# Altium schematic sheet schematic5.SchDoc
size A
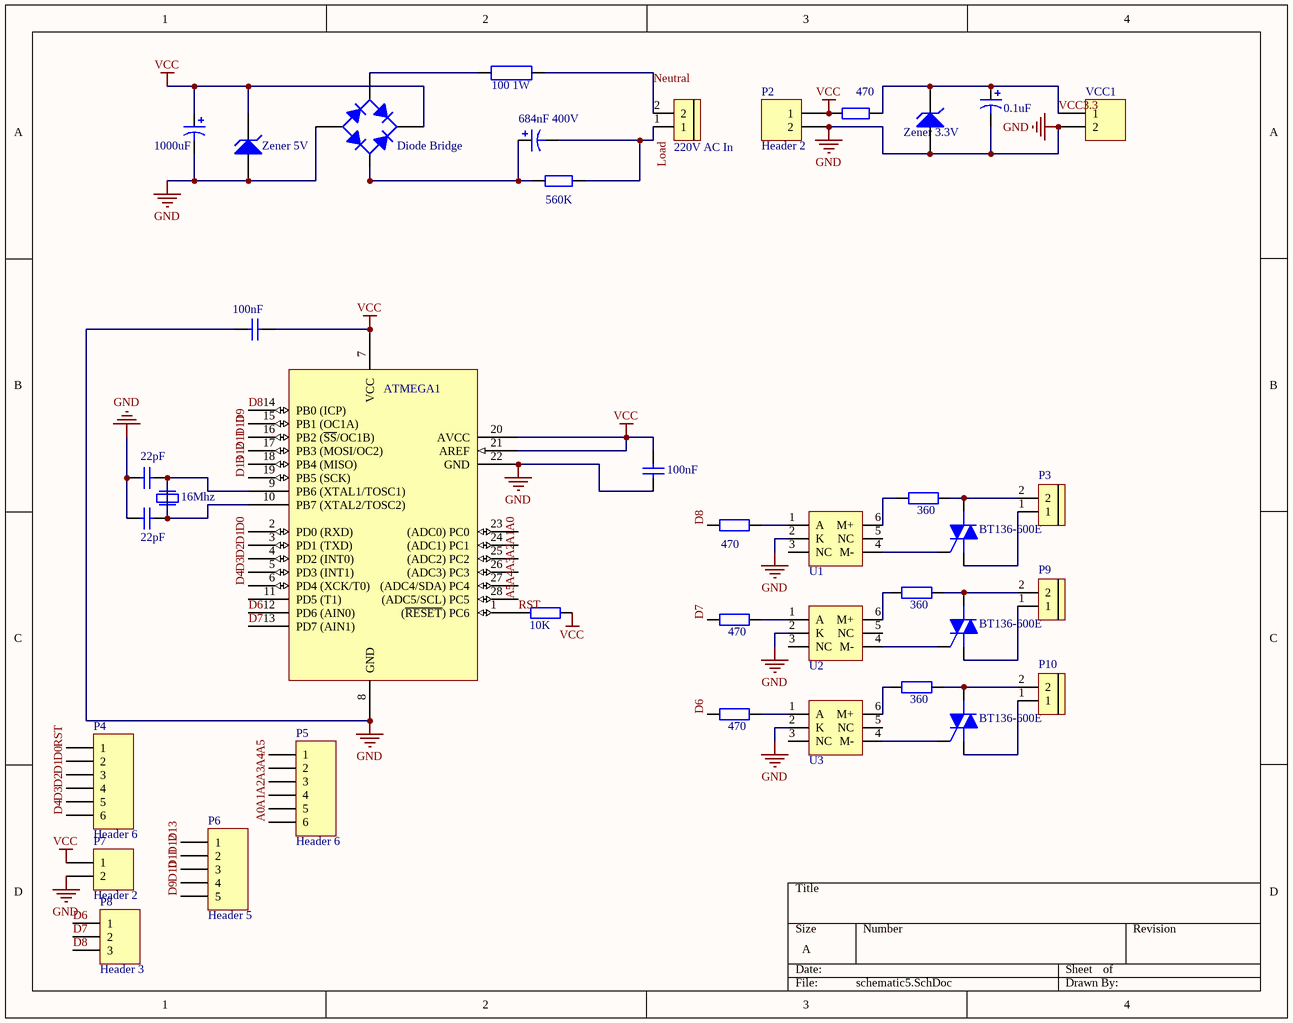
[diagram p0: schematic5.SchDoc]

## Parts
ATMEGA1  ATMEGA8_DIP28  [DIP-28]  (value not drawn)
C1  0.1uF  [C3MM]
C2  684nF 400V  [C10mm]
C3  1000uF  [C10mm]
C4  100nF  [Tu-pico]
C5  22pF  [Tu-pico]
C6  100nF  [Tu-pico]
C7  22pF  [Tu-pico]
Crystal1  16Mhz  [XTAL]
D1  Diode Bridge  [D-38]
D2  Zener 3.3V  [DIODE/NOM/0.5A]
D3  Zener 5V  [DIODE/NOM/0.5A]
P1  220V AC In  [BIG_Header 2]
P2  Header 2  [HDR1X2]
P3  BIG_Header 2  [BIG_Header 2]  (value not drawn)
P4  Header 6  [HDR1X6]
P5  Header 6  [HDR1X6]
P6  Header 5  [HDR1X5]
P7  Header 2  [HDR1X2]
P8  Header 3  [HDR1X3]
P9  BIG_Header 2  [BIG_Header 2]  (value not drawn)
P10  BIG_Header 2  [BIG_Header 2]  (value not drawn)
Q1  BT136-600E  [BTA6-600]
Q2  BT136-600E  [BTA6-600]
Q3  BT136-600E  [BTA6-600]
R1  100 1W  [DIEN TRO 1W (tube)]
R2  value 470  [DIEN TRO 1/4 W]  (hidden comment: R0.4W)
R3  560K  [AXIAL-0.4]
R4  470  [R1/4W]
R5  360  [R1/4W]
R6  10K  [R1/4W]
R7  470  [R1/4W]
R8  360  [R1/4W]
R9  470  [R1/4W]
R10  360  [R1/4W]
U1  MOC3021M  [MOC30XX]  (value not drawn)
U2  MOC3021M  [MOC30XX]  (value not drawn)
U3  MOC3021M  [MOC30XX]  (value not drawn)
VCC1  Header 2  [HDR1X2]  (value not drawn)

## Nets
GND: ATMEGA1.8(GND) ATMEGA1.22(GND) C1.2 C3.2 C4.1 C5.2 C6.1 C7.2 D1.3(A) D2.1(A) D3.1(A) P2.2 P7.2 U1.2(K) U2.2(K) U3.2(K) VCC1.2
VCC: ATMEGA1.7(VCC) ATMEGA1.20(AVCC) ATMEGA1.21(AREF) C3.1 C4.2 C6.2 D1.1(K) D3.2(K) P2.1 P7.1 R2.1 R6.1
A0: ATMEGA1.23((ADC0)_PC0) P5.6
A1: ATMEGA1.24((ADC1)_PC1) P5.5
A2: ATMEGA1.25((ADC2)_PC2) P5.4
A3: ATMEGA1.26((ADC3)_PC3) P5.3
A4: ATMEGA1.27((ADC4/SDA)_PC4) P5.2
A5: ATMEGA1.28((ADC5/SCL)_PC5) P5.1
D0: ATMEGA1.2(PD0_(RXD)) P4.2
D1: ATMEGA1.3(PD1_(TXD)) P4.3
D2: ATMEGA1.4(PD2_(INT0)) P4.4
D3: ATMEGA1.5(PD3_(INT1)) P4.5
D4: ATMEGA1.6(PD4_(XCK/T0)) P4.6
D6: ATMEGA1.12(PD6_(AIN0)) P8.1 R9.1
D7: ATMEGA1.13(PD7_(AIN1)) P8.2 R7.1
D8: ATMEGA1.14(PB0_(ICP)) P8.3 R4.1
D9: ATMEGA1.15(PB1_(OC1A)) P6.5
D10: ATMEGA1.16(PB2_(~{SS}/OC1B)) P6.4
D11: ATMEGA1.17(PB3_(MOSI/OC2)) P6.3
D12: ATMEGA1.18(PB4_(MISO)) P6.2
D13: ATMEGA1.19(PB5_(SCK)) P6.1
Load: C2.2 P1.1 R3.2
Neutral: P1.2 R1.2
RST: ATMEGA1.1((~{RESET})_PC6) P4.1 R6.2
VCC3.3: C1.1 D2.2(K) R2.2 VCC1.1
NetATMEGA1_9: ATMEGA1.9(PB6_(XTAL1/TOSC1)) ATMEGA1.10(PB7_(XTAL2/TOSC2)) C5.1 C7.1 Crystal1.1(P1) Crystal1.2(P2)
NetC2_1: C2.1 D1.2(C) R3.1
NetD1_4: D1.4(C) R1.1
NetP3_1: P3.1 Q1.1(M1)
NetP3_2: P3.2 Q1.2(M2) R5.2
NetP9_1: P9.1 Q2.1(M1)
NetP9_2: P9.2 Q2.2(M2) R8.2
NetP10_1: P10.1 Q3.1(M1)
NetP10_2: P10.2 Q3.2(M2) R10.2
NetQ1_3: Q1.3(G) U1.4(M-)
NetQ2_3: Q2.3(G) U2.4(M-)
NetQ3_3: Q3.3(G) U3.4(M-)
NetR4_2: R4.2 U1.1(A)
NetR5_1: R5.1 U1.6(M+)
NetR7_2: R7.2 U2.1(A)
NetR8_1: R8.1 U2.6(M+)
NetR9_2: R9.2 U3.1(A)
NetR10_1: R10.1 U3.6(M+)

Not connected (* = marked no-connect by the designer): ATMEGA1 11(PD5_(T1)); U1 3(NC) 5(NC); U2 3(NC) 5(NC); U3 3(NC) 5(NC)

## Library data of the parts
ATMEGA1 = ATMEGA8_DIP28: Atmel Microcontroller - Library created by carel..  <www.mpfreezone.com>
C1 = Cap Pol 3mm: Polarized Capacitor (Axial); Published: 8-Jun-2000; LatestRevisionDate: 17-Jul-2002; LatestRevisionNote: Re-released for DXP Platform.; PackageReference: POLAR0.8; Publisher: Altium Limited
C2 = Cap Pol 12mm: Polarized Capacitor (Axial); Published: 8-Jun-2000; LatestRevisionDate: 17-Jul-2002; LatestRevisionNote: Re-released for DXP Platform.; PackageReference: POLAR0.8; Publisher: Altium Limited
C3 = Cap Pol 8mm: Polarized Capacitor (Axial); Published: 8-Jun-2000; LatestRevisionDate: 17-Jul-2002; LatestRevisionNote: Re-released for DXP Platform.; PackageReference: POLAR0.8; Publisher: Altium Limited; Value: 1000uF
C4-C7 = CapCeramic: Capacitor; Published: 8-Jun-2000; LatestRevisionDate: 17-Jul-2002; LatestRevisionNote: Re-released for DXP Platform.; PackageReference: RAD-0.3; Publisher: Altium Limited
  C4 C6: Value: 100nF
  C5 C7: Value: 22pF
Crystal1 = XTAL: Value: 16Mhz
D1 = Bridge1: Full Wave Diode Bridge; Published: 8-Jun-2000; LatestRevisionDate: 29-May-2009; LatestRevisionNote: Sch pins A & K swapped.; DatasheetVersion: E2732B; PackageReference: D-38; Publisher: Altium Limited; PackageDescription: Bridge Rectifier; 4 Terminals; Body 9.4 x 9.4 mm (typ); Pitch 5.08 mm
D2 = Diode Zener: Zener Diode; Published: 8-Jun-2000; LatestRevisionDate: 17-Jul-2002; LatestRevisionNote: Re-released for DXP Platform.; PackageReference: DIODE-0.7; Publisher: Altium Limited
D3 = Diode Zener: Zener Diode; Voltage: 5; Published: 8-Jun-2000; LatestRevisionDate: 17-Jul-2002; LatestRevisionNote: Re-released for DXP Platform.; PackageReference: DIODE-0.7; Publisher: Altium Limited
P1 = BIG_Header 2
P2 P7 VCC1 = Header 2: Header, 2-Pin; LatestRevisionDate: 17-Jul-2002; LatestRevisionNote: Re-released for DXP Platform.; Publisher: Altium Limited
P4 P5 = Header 6: Header, 6-Pin; LatestRevisionDate: 17-Jul-2002; LatestRevisionNote: Re-released for DXP Platform.; Publisher: Altium Limited
P6 = Header 5: Header, 5-Pin; LatestRevisionDate: 17-Jul-2002; LatestRevisionNote: Re-released for DXP Platform.; Publisher: Altium Limited
P8 = Header 3: Header, 3-Pin; LatestRevisionDate: 17-Jul-2002; LatestRevisionNote: Re-released for DXP Platform.; Publisher: Altium Limited
Q1-Q3 = BTA12-600: Silicon Bidirectional Triode Thyristor; Note: Pin 2 is electrically connected to Pin 4 (TAB); Published: 29-Sep-2000; LatestRevisionDate: 17-Jul-2002; LatestRevisionNote: Re-released for DXP Platform.; DatasheetDocument: 1999; PackageReference: 369-03; Publisher: Altium Limited; Code_JEDEC: TO-251-AA; ComponentLink1Description: Manufacturer Link; ComponentLink1URL: http://www.motorola.com/
R1 = Res 1W: 1W Res Power; Value: 100; Voltage: 400; Creator: Nguyen Ba Bien
R2 = Res 1/4 W: Resistor; Published: 8-Jun-2000; LatestRevisionDate: 17-Jul-2002; LatestRevisionNote: Re-released for DXP Platform.; PackageReference: AXIAL-0.4; Publisher: Altium Limited
R3 = Res2: Resistor; Published: 8-Jun-2000; LatestRevisionDate: 17-Jul-2002; LatestRevisionNote: Re-released for DXP Platform.; PackageReference: AXIAL-0.4; Publisher: Altium Limited; PackageDescription: Axial Device, Thru-Hole; 2 Leads; 0.4 in Pin Spacing; Value: 560K
R4-R10 = R1/4W: Resistor
  R4 R7 R9: Value: 470
  R5 R8 R10: Value: 360
  R6: Value: 10K